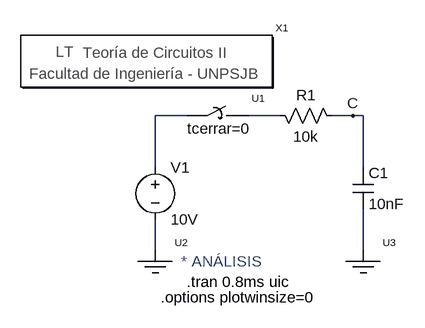
[diagram p0: schematic Transitorio de un Circuito RC.asc]
Transitorio de un Circuito RC.asc, the LTspice schematic file:
Version 4
SHEET 1 880 680
WIRE 112 128 64 128
WIRE 256 128 208 128
WIRE 368 128 336 128
WIRE 384 128 368 128
WIRE 64 208 64 128
WIRE 384 208 384 128
WIRE 64 336 64 288
WIRE 384 336 384 272
FLAG 368 128 C
SYMBOL ltcerrar 160 128 R0
SYMATTR InstName U1
SYMBOL voltage 64 192 R0
WINDOW 123 0 0 Left 2
WINDOW 39 24 124 Left 2
SYMATTR InstName V1
SYMATTR Value 10V
SYMBOL cap 368 208 R0
SYMATTR InstName C1
SYMATTR Value 10nF
SYMBOL res 240 112 M90
WINDOW 0 0 56 VBottom 2
WINDOW 3 32 56 VTop 2
SYMATTR InstName R1
SYMATTR Value 10k
SYMBOL masa 64 352 R0
SYMATTR InstName U2
SYMBOL masa 384 352 R0
SYMATTR InstName U3
SYMBOL Circuitos2\\Letreros\\Teoría\ de\ Circuitos\ II 48 48 R0
SYMATTR InstName X1
TEXT 112 384 Left 2 !.tran 0.8ms uic
TEXT 104 352 Left 2 ;* ANÁLISIS
TEXT 72 408 Left 2 !.options plotwinsize=0

The netlist it stands for:
* Transitorio de un Circuito RC.asc
XU1 N001 N002 Ltcerrar Ltcerrar tcerrar=0 ttran=1u Rclosed=1m Ropen=1T  ; pins 1 2
V1 N001 N003 10V
C1 C N004 10nF
R1 N002 C 10k
XU2 N003 masa masa  ; pins 1
XU3 N004 masa masa  ; pins 1
XX1 Teoría de Circuitos II
.tran 0.8ms uic
* * ANÁLISIS
.options plotwinsize=0
.lib ..\sym\Circuitos2\Llaves\llaves.lib
.lib ..\sym\Circuitos2\Fuentes\Fuentes.lib
.backanno
.end